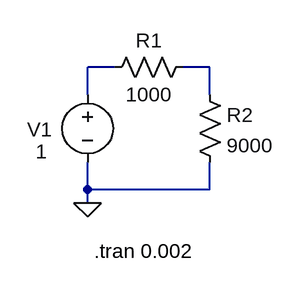
[diagram p0: schematic CircuitB-PartA-DC.asc]
CircuitB-PartA-DC.asc, the LTspice schematic file:
Version 4.1
SHEET 1 880 680
WIRE 160 112 128 112
WIRE 272 112 240 112
WIRE 128 144 128 112
WIRE 272 144 272 112
WIRE 128 256 128 224
WIRE 272 256 272 224
WIRE 272 256 128 256
WIRE 128 272 128 256
FLAG 128 272 0
SYMBOL res 256 96 R90
WINDOW 0 0 56 VBottom 2
WINDOW 3 32 56 VTop 2
SYMATTR InstName R1
SYMATTR Value 1000
SYMBOL res 256 128 R0
SYMATTR InstName R2
SYMATTR Value 9000
SYMBOL voltage 128 128 R0
WINDOW 0 -71 57 Left 2
WINDOW 3 -61 83 Left 2
WINDOW 123 0 0 Left 0
WINDOW 39 0 0 Left 0
SYMATTR InstName V1
SYMATTR Value 1
TEXT 136 328 Left 2 !.tran 0.002

The netlist it stands for:
* CircuitB-PartA-DC.asc
R1 N002 N001 1000
R2 N002 0 9000
V1 N001 0 1
.tran 0.002
.backanno
.end